# Altium project Moki V3.PrjPcb
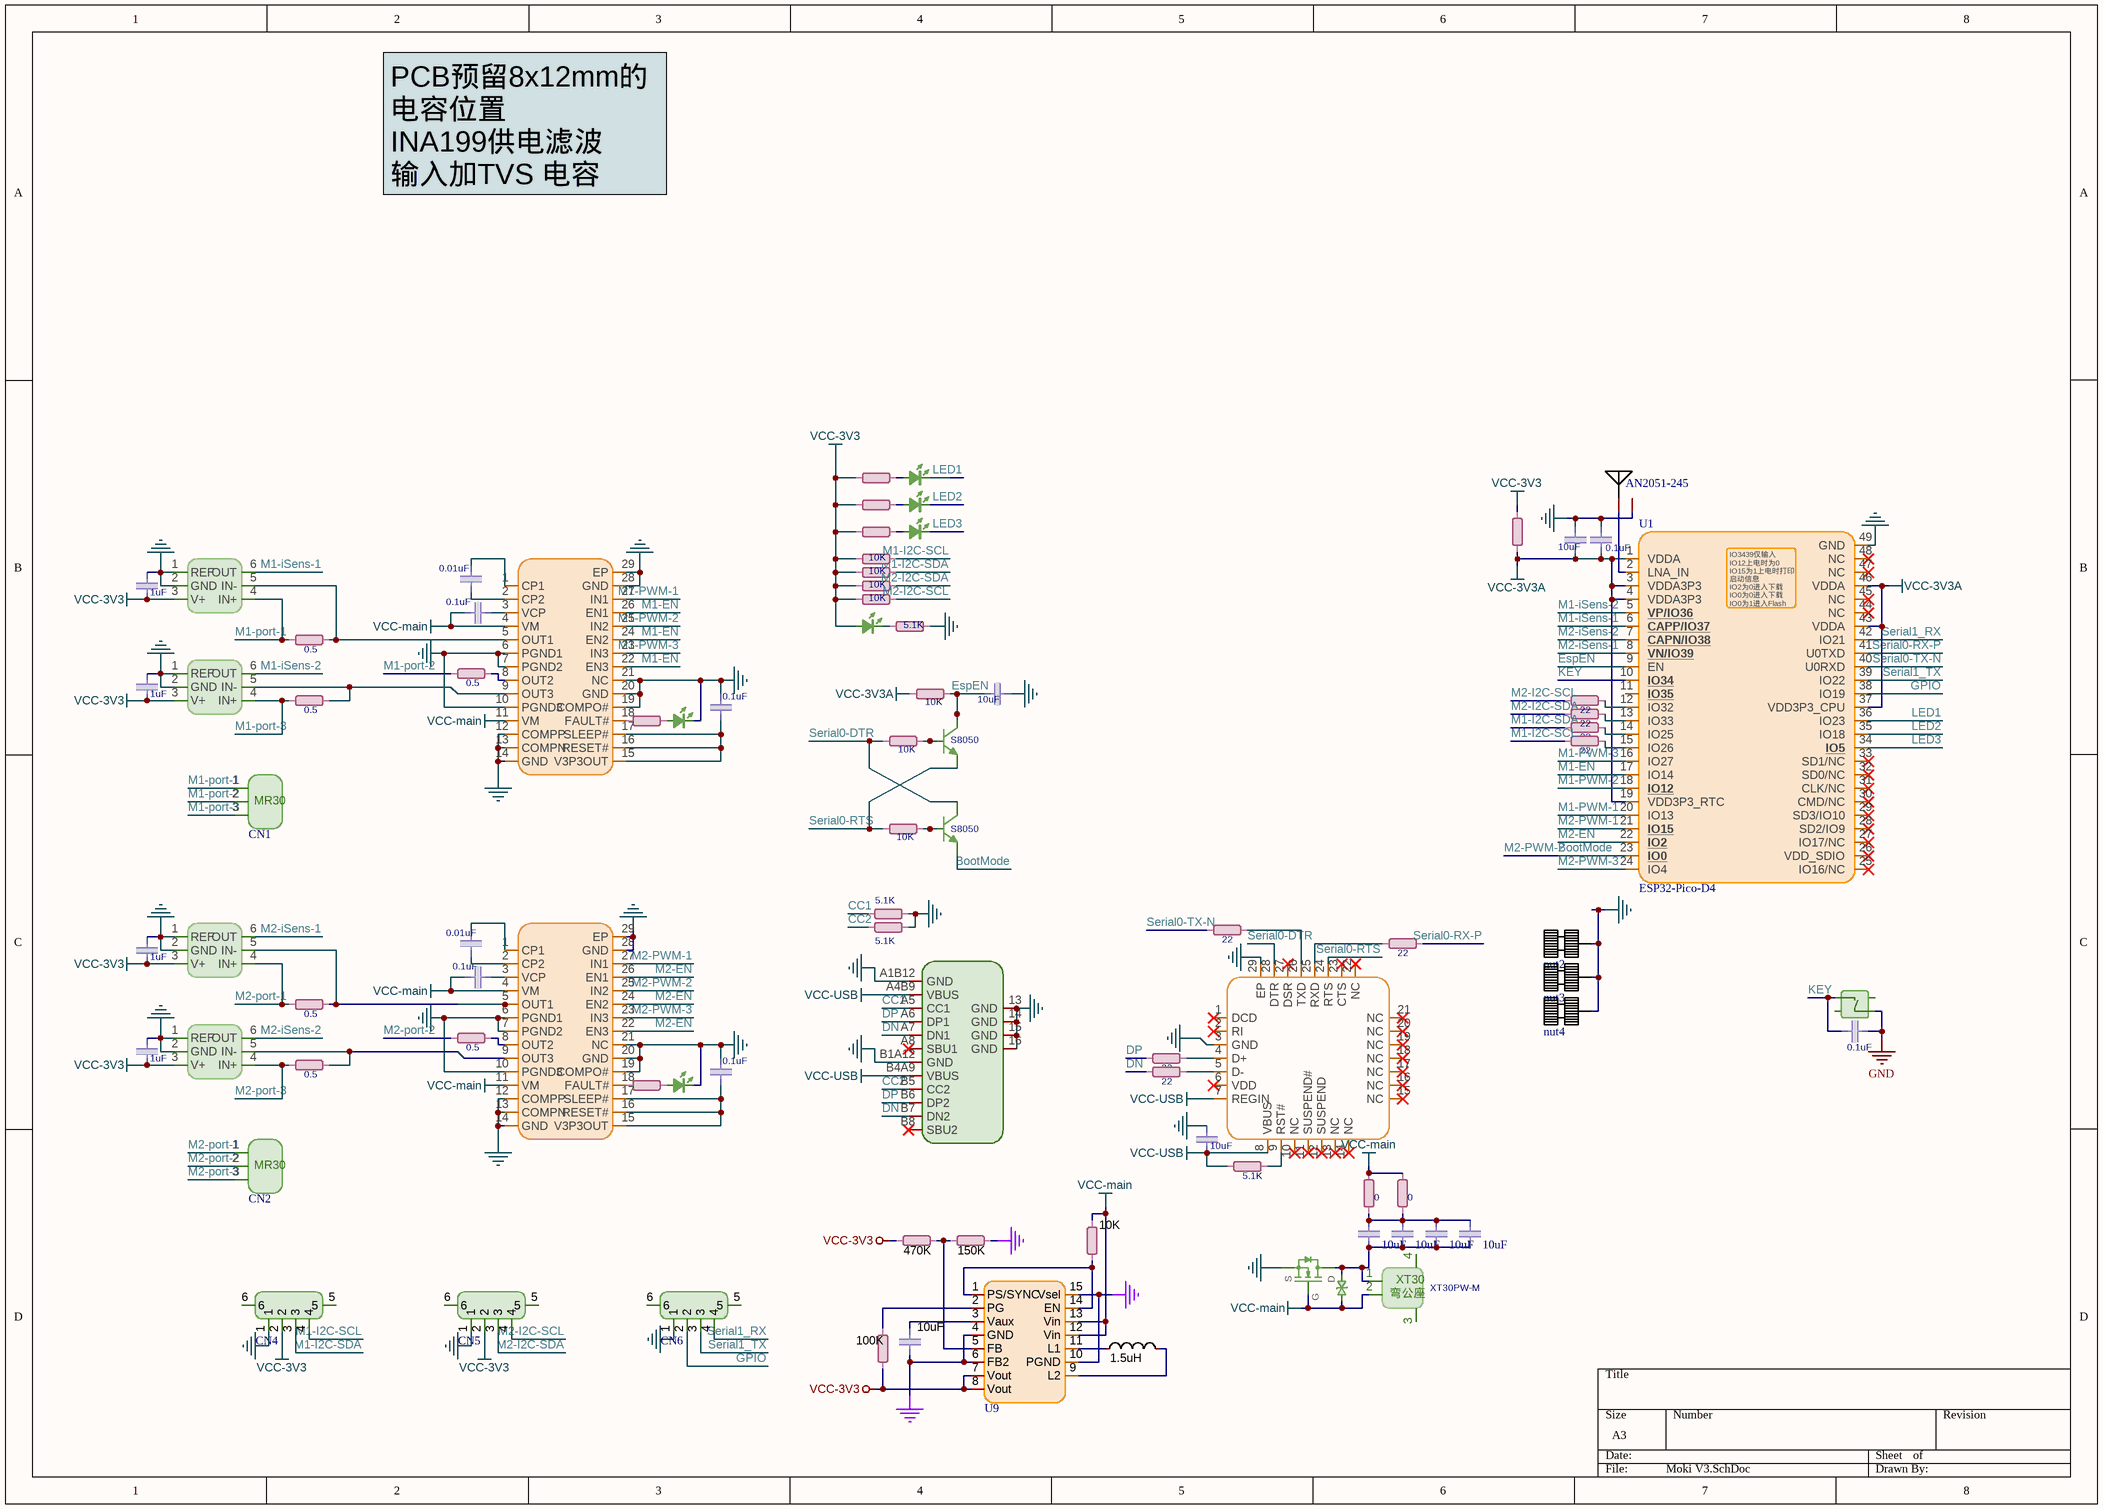
[diagram p0: Moki V3.SchDoc]
1 sheet, 89 parts. Net scope: global (net labels, ports and power ports of the same name join across sheets).
Board file: Moki V3.PcbDoc

## Sheet Moki V3.SchDoc
size A3; SheetNumber: 1; SheetTotal: 1

### Parts
*1  AN2051-245  [AN2051-245]
*2  S8050  [SOT22-3]
*3  S8050  [SOT22-3]
*4  CP2102  [QFN-28]  (value not drawn)
*6  贴片按键  [SW-SMD_4P-L4.2-W3.3-P2.15-LS5.1]  (value not drawn)
C1  10uF  [电容-0402]
C2  0.1uF  [电容-0402]
C3  0.01uF  [电容-0402]
C4  1uF  [电容-0402]
C5  0.1uF  [电容-0402]
C6  10uF  [电容-0402]
C7  1uF  [电容-0402]
C8  0.1uF  [电容-0402]
C9  10uF  [C1206]
C10  10uF  [C1206]
C11  10uF  [C1206]
C12  10uF  [C1206]
C14  0.1uF  [电容-0402]
C15  0.01uF  [电容-0402]
C16  1uF  [电容-0402]
C17  0.1uF  [电容-0402]
C18  1uF  [电容-0402]
C19  0.1uF  [电容-0402]
C23  10uF  [电容-0402]
C25  10uF  [电容-0402]
CN1  MR30PW-F  [CONN-TH_MR30-M]  (value not drawn)
CN2  MR30PW-F  [CONN-TH_MR30-M]  (value not drawn)
CN3  XT30PW-M  [CONN-TH_XT30PW-M]
CN4  A1257WR-S-4P  [CONN-SMD_A1257WR-S-4P]  (value not drawn)
CN5  A1257WR-S-4P  [CONN-SMD_A1257WR-S-4P]  (value not drawn)
CN6  A1257WR-S-4P  [CONN-SMD_A1257WR-S-4P]  (value not drawn)
L1  LED-0402  [LED-0402]  (value not drawn)
L2  LED-0402  [LED-0402]  (value not drawn)
L3  LED-0402  [LED-0402]  (value not drawn)
L4  LED-0402  [LED-0402]  (value not drawn)
L5  LED-0402  [LED-0402]  (value not drawn)
L6  LED-0402  [LED-0402]  (value not drawn)
L7  value 1.5uH  [IND-SMD_L4.0-W4.0]  (hidden comment: SWPA4020S1R5NT)
nut2  贴片螺母-m2  [贴片螺母-m2]  (value not drawn)
nut3  贴片螺母-m2  [贴片螺母-m2]  (value not drawn)
nut4  贴片螺母-m2  [贴片螺母-m2]  (value not drawn)
Q1  AO3400_C181090  [SOT-23-3_L2.9-W1.3-P1.90-LS2.4-BR]  (value not drawn)
R1  5.1K  [电阻-0402]  (value not drawn)
R2  5.1K  [电阻-0402]  (value not drawn)
R3  5.1K  [电阻-0402]  (value not drawn)
R4  0  [电阻-0402]  (value not drawn)
R5  10K  [电阻-0402]
R6  10K  [电阻-0402]
R7  10K  [电阻-0402]
R8  10K  [电阻-0402]
R9  5.1K  [电阻-0402]
R10  0.5  [R0603_L]
R11  10K  [电阻-0402]
R12  5.1K  [电阻-0402]  (value not drawn)
R13  0.5  [R0603_L]
R14  10K  [电阻-0402]
R15  10K  [电阻-0402]
R16  5.1K  [电阻-0402]
R17  5.1K  [电阻-0402]
R18  0.5  [R0603_L]
R19  5.1K  [电阻-0402]  (value not drawn)
R20  0.5  [R0603_L]
R21  5.1K  [电阻-0402]
R22  10K  [电阻-0402]
R23  470K  [电阻-0402]
R24  150K  [电阻-0402]
R25  100K  [电阻-0402]
R26  0  [R0603_L]
R27  0.5  [R0603_L]
R28  0.5  [R0603_L]
R29  0  [R0603_L]
R30  22  [电阻-0402]
R31  22  [电阻-0402]
R32  22  [电阻-0402]
R33  22  [电阻-0402]
R34  22  [电阻-0402]
R35  22  [电阻-0402]
R36  22  [电阻-0402]
R37  22  [电阻-0402]
U1  ESP32-Pico-D4  [QFN-48_7X7]
U2  INA199B1DCKR  [SC-70-6_L2.2-W1.3-P0.65-LS2.1-BL]  (value not drawn)
U3  INA199B1DCKR  [SC-70-6_L2.2-W1.3-P0.65-LS2.1-BL]  (value not drawn)
U4  DRV8313PWPR  [HTSSOP-28_L9.8-W4.5-P0.65-LS6.6-BL-EP]  (value not drawn)
U5  INA199B1DCKR  [SC-70-6_L2.2-W1.3-P0.65-LS2.1-BL]  (value not drawn)
U6  INA199B1DCKR  [SC-70-6_L2.2-W1.3-P0.65-LS2.1-BL]  (value not drawn)
U8  5.0SMDJ24CA  [SMC_L6.9-W5.9-LS7.9-BI]  (value not drawn)
U9  TPS63070RNMR  [VQFN-HR-15_L3.0-W2.5-P0.50-BL_TPS63070RNMR]  (value not drawn)
U?  DRV8313PWPR  [HTSSOP-28_L9.8-W4.5-P0.65-LS6.6-BL-EP]  (value not drawn)
USBC1  TYPE-C 2.0 -16P  [USB-C-SMD_16P]  (value not drawn)

### Nets
GND: *1.2 *4.3(GND) *4.29(EP) *6.4 C1.2 C2.2 C4.1 C6.2 C7.1 C8.1 C14.1 C16.1 C18.1 C19.1 C23.1 C25.1 CN4.1 CN5.1 CN6.1 L5.2(K) L6.2(K) nut2.0 nut3.0 nut4.0 Q1.2(S) R9.2 R16.2 R17.2 R24.1 U1.49(GND) U2.1(REF) U2.2(GND) U3.1(REF) U3.2(GND) U4.6(PGND1) U4.7(PGND2) U4.10(PGND3) U4.12(COMPP) U4.13(COMPN) U4.14(GND) U4.19(COMPO#) U4.20(GND) U4.21(NC) U4.28(GND) U4.29(EP) U5.1(REF) U5.2(GND) U6.1(REF) U6.2(GND) U9.4(GND) U9.6(FB2) U9.10(PGND) U9.15(Vsel) U?.6(PGND1) U?.7(PGND2) U?.10(PGND3) U?.12(COMPP) U?.13(COMPN) U?.14(GND) U?.19(COMPO#) U?.20(GND) U?.21(NC) U?.28(GND) U?.29(EP) USBC1.13(GND) USBC1.14(GND) USBC1.15(GND) USBC1.16(GND) USBC1.A1B12(GND) USBC1.B1A12(GND)
VCC-3V3: C4.2 C7.2 C16.2 C18.2 CN4.2 CN5.2 L4.1(A) R1.1 R2.1 R3.1 R4.2 R5.1 R6.1 R7.1 R8.1 R23.2 R25.1 U2.3(V+) U3.3(V+) U5.3(V+) U6.3(V+) U9.7(Vout) U9.8(Vout)
VCC-3V3A: C1.1 C2.1 R4.1 R11.2 U1.1(VDDA) U1.3(VDDA3P3) U1.4(VDDA3P3) U1.19(VDD3P3_RTC) U1.37(VDD3P3_CPU) U1.43(VDDA) U1.46(VDDA)
VCC-main: C5.2 C17.2 CN3.2 Q1.1(G) R22.2 R26.2 R29.2 U4.4(VM) U4.11(VM) U8.1 U9.12(Vin) U9.13(Vin) U?.4(VM) U?.11(VM)
VCC-USB: *4.7(REGIN) *4.8(VBUS) C23.2 R21.1 USBC1.A4B9(VBUS) USBC1.B4A9(VBUS)
BootMode: *3.2(E) U1.23(IO0) U?.25(IN2)  [also labelled M2-PWM-2]
CC1: R16.1 USBC1.A5(CC1)
CC2: R17.1 USBC1.B5(CC2)
DN: R33.1 USBC1.A7(DN1) USBC1.B7(DN2)
DP: R32.1 USBC1.A6(DP1) USBC1.B6(DP2)
EspEN: *2.3(C) C6.1 R11.1 U1.9(EN)
GPIO: CN6.2 U1.38(IO19)
KEY: *6.1 C14.2 U1.10(IO34)
LED1: L1.2(K) U1.36(IO23)
LED2: L2.2(K) U1.35(IO18)
LED3: L3.2(K) U1.34(IO5)
M1-EN: U1.17(IO14) U4.22(EN3) U4.24(EN2) U4.26(EN1)
M1-I2C-SCL: CN4.4 R5.2 R37.1
M1-I2C-SDA: CN4.3 R6.2 R36.1
M1-iSens-1: U1.6(CAPP/IO37) U2.6(OUT)
M1-iSens-2: U1.5(VP/IO36) U3.6(OUT)
M1-port-1: CN1.1 R10.1 U2.4(IN+)
M1-port-2: CN1.2 R27.1
M1-port-3: CN1.3 R13.1 U3.4(IN+)
M1-PWM-1: U1.20(IO13) U4.27(IN1)
M1-PWM-2: U1.18(IO12) U4.25(IN2)
M1-PWM-3: U1.16(IO27) U4.23(IN3)
M2-EN: U1.22(IO2) U?.22(EN3) U?.24(EN2) U?.26(EN1)
M2-I2C-SCL: CN5.4 R8.2 R34.1
M2-I2C-SDA: CN5.3 R7.2 R35.1
M2-iSens-1: U1.8(VN/IO39) U5.6(OUT)
M2-iSens-2: U1.7(CAPN/IO38) U6.6(OUT)
M2-port-1: CN2.1 R18.1 U5.4(IN+)
M2-port-2: CN2.2 R28.1
M2-port-3: CN2.3 R20.1 U6.4(IN+)
M2-PWM-1: U1.21(IO15) U?.27(IN1)
M2-PWM-3: U1.24(IO4) U?.23(IN3)
Serial0-DTR: *3.3(C) *4.28(DTR) R14.1
Serial0-RTS: *2.2(E) *4.24(RTS) R15.1
Serial0-RX-P: R31.2 U1.41(U0TXD)
Serial0-TX-N: R30.1 U1.40(U0RXD)
Serial1_RX: CN6.4 U1.42(IO21)
Serial1_TX: CN6.3 U1.39(IO22)
Net*1_1: *1.1(ANT) U1.2(LNA_IN)
Net*2_1: *2.1(B) R14.2
Net*3_1: *3.1(B) R15.2
Net*4_4: *4.4(D+) R32.2
Net*4_5: *4.5(D-) R33.2
Net*4_9: *4.9(RST#) R21.2
Net*4_25: *4.25(RXD) R31.1
Net*4_26: *4.26(TXD) R30.2
NetC3_1: C3.1 U4.2(CP2)
NetC3_2: C3.2 U4.1(CP1)
NetC5_1: C5.1 U4.3(VCP)
NetC8_2: C8.2 U4.15(V3P3OUT) U4.16(RESET#) U4.17(SLEEP#)
NetC9_1: C9.1 C10.1 C11.1 C12.1 CN3.1 Q1.3(D) U8.2
NetC9_2: C9.2 C10.2 C11.2 C12.2 R26.1 R29.1
NetC15_1: C15.1 U?.2(CP2)
NetC15_2: C15.2 U?.1(CP1)
NetC17_1: C17.1 U?.3(VCP)
NetC19_2: C19.2 U?.15(V3P3OUT) U?.16(RESET#) U?.17(SLEEP#)
NetC25_2: C25.2 U9.3(Vaux)
NetL1_1: L1.1(A) R1.2
NetL2_1: L2.1(A) R2.2
NetL3_1: L3.1(A) R3.2
NetL4_2: L4.2(K) R9.1
NetL5_1: L5.1(A) R12.2
NetL6_1: L6.1(A) R19.2
NetL7_1: L7.1 U9.11(L1)
NetL7_2: L7.2 U9.9(L2)
NetR10_2: R10.2 U2.5(IN-) U4.5(OUT1)
NetR12_1: R12.1 U4.18(FAULT#)
NetR13_2: R13.2 U3.5(IN-) U4.9(OUT3)
NetR18_2: R18.2 U5.5(IN-) U?.5(OUT1)
NetR19_1: R19.1 U?.18(FAULT#)
NetR20_2: R20.2 U6.5(IN-) U?.9(OUT3)
NetR22_1: R22.1 U9.1(PS/SYNC) U9.14(EN)
NetR23_1: R23.1 R24.2 U9.5(FB)
NetR25_2: R25.2 U9.2(PG)
NetR27_2: R27.2 U4.8(OUT2)
NetR28_2: R28.2 U?.8(OUT2)
NetR34_2: R34.2 U1.12(IO32)
NetR35_2: R35.2 U1.13(IO33)
NetR36_2: R36.2 U1.14(IO25)
NetR37_2: R37.2 U1.15(IO26)

Not connected (* = marked no-connect by the designer): *4 1(DCD)* 2(RI)* 6(VDD)* 10(NC)* 11(SUSPEND#)* 12(SUSPEND)* 13(NC)* 14(NC)* 15(NC)* 16(NC)* 17(NC)* 18(NC)* 19(NC)* 20(NC)* 21(NC)* 22(NC)* 23(CTS)* 27(DSR)*; *6 2 3; CN3 3 4; CN4 5 6; CN5 5 6; CN6 5 6; U1 11(IO35) 25(IO16/NC)* 26(VDD_SDIO)* 27(IO17/NC)* 28(SD2/IO9)* 29(SD3/IO10)* 30(CMD/NC)* 31(CLK/NC)* 32(SD0/NC)* 33(SD1/NC)* 44(NC)* 45(NC)* 47(NC)* 48(NC)*; USBC1 A8(SBU1)* B8(SBU2)*

### Notes on the sheet
- PCB预留8x12mm的电容位置
  INA199供电滤波
  输入加TVS 电容
  加限流电阻
- (in symbol ESP32-Pico-D4) IO3439仅输入 / IO12上电时为0 / IO15为1上电时打印启动信息 / IO2为0进入下载 / IO0为0进入下载 / IO0为1进入Flash / IO5上电为1 /
- (in symbol MR30侧贴) MR30
- (in symbol XT30PW-M) XT30; 弯公座

### Library data of the parts
C1-C12 C14-C19 C23 C25 = 电容: 贴片电容/MLCC电容; BOM名称: 无极性贴片电容
CN1 CN2 = MR30侧贴: Add into BOM: yes; Name: MR30PW-F; Symbol: MR30PW-F; Device: MR30PW-F; LCSC Part Name: MR30PW-F; Supplier Part: C2928110; Manufacturer Part: MR30PW-F; Supplier Footprint: Through hole; JLCPCB Part Class: 扩展库; Supplier: LCSC; Convert to PCB: yes
CN3 = XT30PW-M: Socket,DCsupply,XT30,male,PIN:2; Manufacturer: AMASS(艾迈斯); Add into BOM: yes; Name: XT30PW-M; Symbol: XT30PW-M; Device: XT30PW-M; LCSC Part Name: XT30PW-M公头; Supplier Part: C431092; Manufacturer Part: XT30PW-M; Supplier Footprint: -; JLCPCB Part Class: 扩展库; Datasheet: https://atta.szlcsc.com/upload/public/pdf/source/20220222/6A9F22F7850E25B33E1BE430ADF8560B.pdf; Supplier: LCSC; Convert to PCB: yes
CN4-CN6 = GH1.25*4P: 参考系列:GH;间距:1.25mm;插针结构:1x4P;排数:1;每排PIN数:4;行距:-;安装方式:-;触头材质:黄铜;; Manufacturer: CJT(长江连接器); Add into BOM: yes; Reference Series: GH; Pitch: 1.25mm; Pins Structure: 1x4P; Number of PINs Per Row: 4; Name: A1257WR-S-4P; Symbol: A1257WR-S-4P; Device: A1257WR-S-4P; LCSC Part Name: GH1.25卧式贴片 镀锡 4P 针座连接器; Supplier Part: C225127; Manufacturer Part: A1257WR-S-4P; Supplier Footprint: SMD,P=1.25mm; JLCPCB Part Class: Extended Part; Datasheet: https://atta.szlcsc.com/upload/public/pdf/source/20180509/C225127_D8D3C7F8F1F45F960D198B1E232900BE.pdf; Supplier: LCSC; Convert to PCB: yes; Number of Rows: 1; Row Spacing: -; Mounting Style: -; Contact Material: 黄铜
L7 = SWPA4020S1R5NT: 电感值:1.5uH;精度:±30%;额定电流:1.98A;饱和电流(Isat):4.45A;直流电阻(DCR):35mΩ;; Manufacturer: Sunlord(顺络); Add into BOM: yes; Tolerance: ±30%; Rated Current: 1.98A; Saturation Current (Isat): 4.45A; DC Resistance (DCR): 35mΩ; Name: 1.5uH; Symbol: SWPA4020S1R5NT; Device: SWPA4020S1R5NT; LCSC Part Name: 1.5uH ±30% 1.98A 35mΩ; Supplier Part: C42099; Manufacturer Part: SWPA4020S1R5NT; Supplier Footprint: SMD; JLCPCB Part Class: 扩展库; Datasheet: https://atta.szlcsc.com/upload/public/pdf/source/20210916/AC798BA7E846B7D0B6818F45CD84DB0B.pdf; Supplier: LCSC; Convert to PCB: yes
Q1 = AO3400: 类型:N沟道;漏源电压(Vdss):30V;连续漏极电流(Id):5.8A;功率(Pd):350mW;导通电阻(RDS(on)@Vgs,Id):35mΩ@10V,5.8A;阈值电压(Vgs(th)@Id):1.4V@250uA;; Manufacturer: Hottech(合科泰); Add into BOM: yes; Type: N沟道; Drain Source Voltage (Vdss): 30V; Power Dissipation (Pd): 350mW; Name: AO3400; Symbol: AO3400_C181090; Device: AO3400_C181090; LCSC Part Name: N沟道 30V 5.8A; Supplier Part: C181090; Manufacturer Part: AO3400; Supplier Footprint: SOT-23-3; JLCPCB Part Class: 扩展库; Datasheet: https://atta.szlcsc.com/upload/public/pdf/source/20220427/6A3871894567E8883DB64081D5FF8011.pdf; Supplier: LCSC; Convert to PCB: yes; Continuous Drain Current (Id): 5.8A; Drain Source On Resistance (RDS(on)@Vgs,Id): 35mΩ@10V,5.8A; Gate Threshold Voltage (Vgs(th)@Id): 1.4V@250uA
R1-R37 = 电阻: 贴片电阻; BOM名称: 贴片电阻
U2 U3 U5 U6 = INA199B1DCKR: INA199 26V、双向、零漂移、低侧/高侧、电压输出分流监控器; Manufacturer: TI(德州仪器); Add into BOM: yes; Symbol: INA199B1DCKR; Device: INA199B1DCKR; LCSC Part Name: INA199B1DCKR; Supplier Part: C398920; Manufacturer Part: INA199B1DCKR; Supplier Footprint: SC-70-6; JLCPCB Part Class: Extended Part; Datasheet: https://atta.szlcsc.com/upload/public/pdf/source/20190618/C398920_11F1AA1C0E9C9D9BC4E845E2D57884D2.pdf; Supplier: LCSC; Convert to PCB: yes
U4 U? = DRV8313PWPR: DRV8313 三路 1/2 H 桥驱动器 IC; Manufacturer: TI(德州仪器); Add into BOM: yes; Name: DRV8313PWPR; Symbol: DRV8313PWPR; Device: DRV8313PWPR; LCSC Part Name: DRV8313PWPR; Supplier Part: C92482; Manufacturer Part: DRV8313PWPR; Supplier Footprint: HTSSOP-28; JLCPCB Part Class: 扩展库; Datasheet: https://atta.szlcsc.com/upload/public/pdf/source/20180307/C92482_15204091381071407760.pdf; Supplier: LCSC; Convert to PCB: yes
U8 = MDJ24CA: 极性:双向;反向截止电压(Vrwm):24V;击穿电压:26.7V;反向漏电流(Ir):5uA;峰值脉冲电流(Ipp)@10/1000μs:129A;最大钳位电压:38.9V;峰值脉冲功率(Ppp)@10/1000μs:5kW;; Manufacturer: PAKER(派克微); Symbol: 5.0SMDJ24CA_C3012614; Add into BOM: yes; Polarity: 双向; Reverse Stand-Off Voltage (Vrwm): 24V; Breakdown Voltage: 26.7V; Reverse Leakage Current (Ir): 5uA; Peak Pulse Current (Ipp)@10/1000μs: 129A; Maximum Clamping Voltage: 38.9V; Peak Pulse Power Dissipation (Ppp)@10/1000μs: 5kW; Name: 5.0SMDJ24CA; Device: 5.0SMDJ24CA_C3012614; LCSC Part Name: 双向 Vrwm:24V 5kW; Supplier Part: C3012614; Manufacturer Part: 5.0SMDJ24CA; Supplier Footprint: SMC; JLCPCB Part Class: Extended Part; Datasheet: https://atta.szlcsc.com/upload/public/pdf/source/20220607/733F7EF8A256C9AB9E3BF6EBC63A8845.pdf; Supplier: LCSC; Convert to PCB: yes
U9 = TPS63070RNMR: 功能类型:升降压型;同步整流:是;输出通道数:1;拓扑结构:降压-升压式;输入电压:2V~16V;输出电压:2.5V~9V;输出电流(最大值):2A;开关频率:2.4MHz;; Manufacturer: TI(德州仪器); Add into BOM: yes; Function: 升降压型; Synchronous Rectification: 是; Number of Outputs: 1; Topology: 降压-升压式; Input Voltage: 2V~16V; Output Current (Max): 2A; Switching Frequency: 2.4MHz; Name: TPS63070RNMR; Symbol: TPS63070RNMR; Device: TPS63070RNMR; LCSC Part Name: 升降压型 2V~16V 2A 2.4MHz; Supplier Part: C109322; Manufacturer Part: TPS63070RNMR; Supplier Footprint: VQFN-HR-15; Datasheet: https://atta.szlcsc.com/upload/public/pdf/source/20170810/C109322_1502335154724879675.pdf; Supplier: LCSC; Convert to PCB: yes; Output Voltage: 2.5V~9V
USBC1 = Type-C_16Pin: USB2.0_Type-C_16Pin母座